# Altium schematic sheet MCU.SchDoc
size A
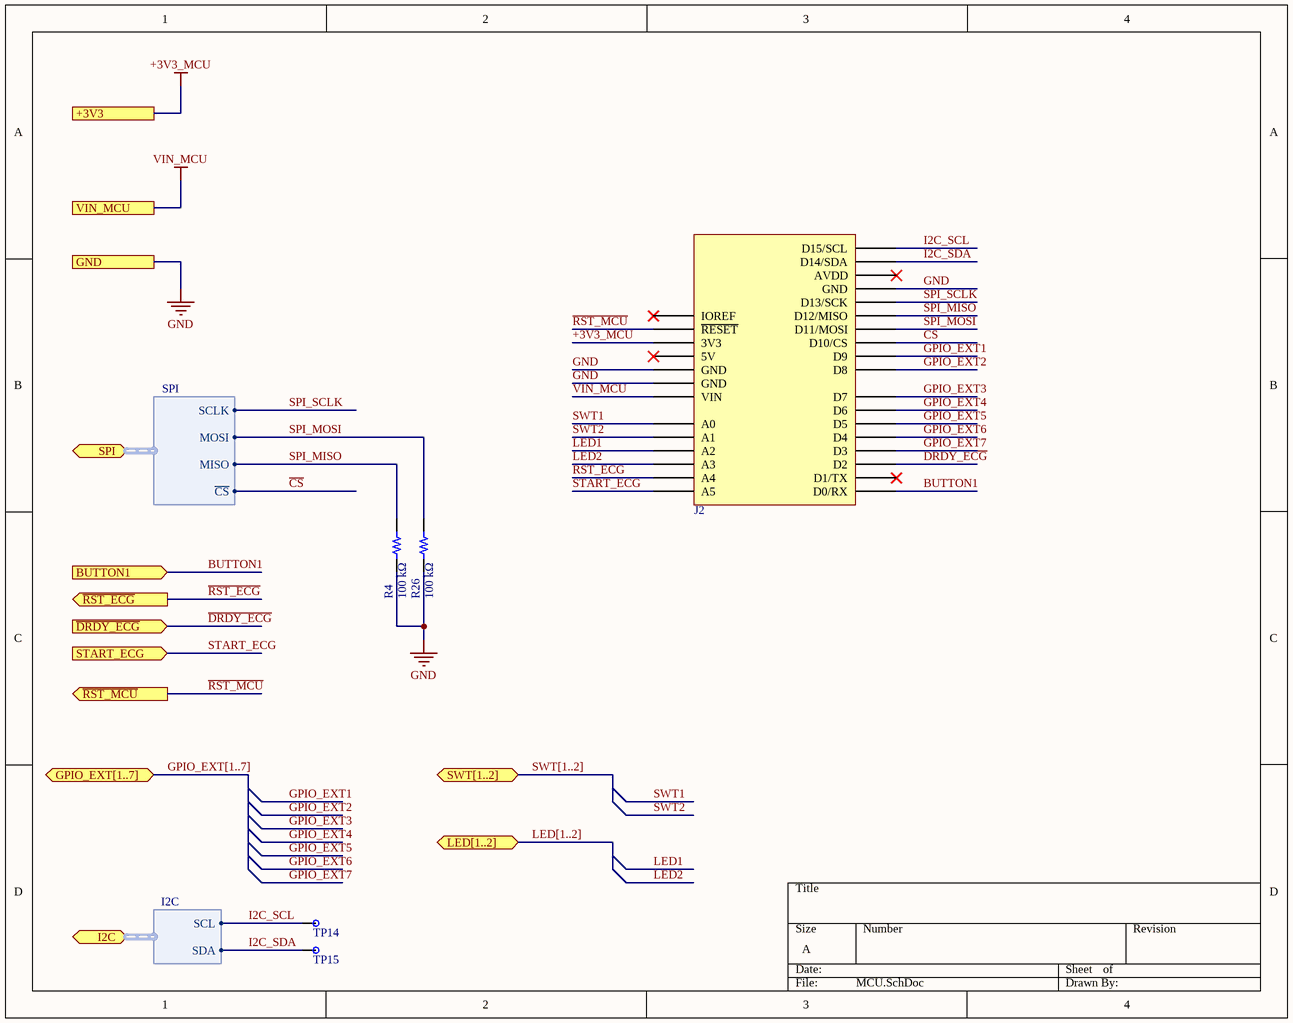
[diagram p0: MCU.SchDoc]

## Parts
J2  920-0088-01  [SCHMARTBOARD - 920-0088-01]  (value not drawn)
R4  100 kΩ  [RES 0402_1005]
R26  100 kΩ  [RES 0402_1005]
TP14  TP1MM  [Test Point 1MM]  (value not drawn)  (no BOM)
TP15  TP1MM  [Test Point 1MM]  (value not drawn)  (no BOM)

## Ports
+3V3, BUTTON1 (in), GND, GPIO_EXT[1..7] (bidir), I2C (bidir, harness I2C), LED[1..2] (bidir), SPI (bidir, harness SPI), START_ECG (in), SWT[1..2] (bidir), VIN_MCU, ~{DRDY_ECG} (in), ~{RST_ECG} (out), ~{RST_MCU} (out)

## Harnesses
SPI: SCLK, MOSI, MISO, ~{CS}
I2C: SCL, SDA

## Nets
+3V3_MCU: J2.4(3V3) ; port +3V3
GND: J2.6(GND) J2.7(GND) J2.29(GND) R4.2 R26.2 ; port GND
VIN_MCU: J2.8(VIN) ; port VIN_MCU
~{RST_MCU}: J2.3(~{RESET}) ; port ~{RST_MCU}
BUTTON1: J2.15(D0/RX) ; port BUTTON1
~{CS}: J2.25(D10/CS) ; port SPI.~{CS}
~{DRDY_ECG}: J2.17(D2) ; port ~{DRDY_ECG}
GPIO_EXT1: J2.24(D9)
GPIO_EXT2: J2.23(D8)
GPIO_EXT3: J2.22(D7)
GPIO_EXT4: J2.21(D6)
GPIO_EXT5: J2.20(D5)
GPIO_EXT6: J2.19(D4)
GPIO_EXT7: J2.18(D3)
I2C_SCL: J2.32(D15/SCL) TP14.1 ; port I2C.SCL
I2C_SDA: J2.31(D14/SDA) TP15.1 ; port I2C.SDA
LED1: J2.11(A2)
LED2: J2.12(A3)
~{RST_ECG}: J2.13(A4) ; port ~{RST_ECG}
SPI_MISO: J2.27(D12/MISO) R4.1 ; port SPI.MISO
SPI_MOSI: J2.26(D11/MOSI) R26.1 ; port SPI.MOSI
SPI_SCLK: J2.28(D13/SCK) ; port SPI.SCLK
START_ECG: J2.14(A5) ; port START_ECG
SWT1: J2.9(A0)
SWT2: J2.10(A1)

Not connected (* = marked no-connect by the designer): J2 2(IOREF)* 5(5V)* 16(D1/TX)* 30(AVDD)*

## Buses and harness runs
bus GPIO_EXT[1..7] = port GPIO_EXT[1..7]
bus LED[1..2] = port LED[1..2]
bus SWT[1..2] = port SWT[1..2]

## Library data of the parts
J2 = 920-0088-01: CONN HDR 8/10P 0.1 GOLD PCB 6PC; Manufacturer: Schmartboard, Inc.; Connector Type: Header; Contact Length - Post: 0.413" (10.50mm); Number of Positions: 6, 8, 10; Number of Positions Loaded: All; Pitch - Mating: 0.100" (2.54mm); Style: Board to Board; Part Number: 920-0088-01; ComponentLink1Description: Datasheet; ComponentLink1URL: http://schmartboard.com/content/Brochures/920-0088-01.pdf; ComponentLink2Description: DigiKey Link; ComponentLink2URL: http://digikey.com/product-detail/en/schmartboard-inc/920-0088-01/1988-1036-ND/9559319; Contact Finish - Mating: Gold; Contact Finish - Post: Gold; Contact Type: Female Socket; Fastening Type: Push-Pull; Insulation Color: Black; Insulation Height: 0.335" (8.51mm); LastUpdated: 2020-02-03 5:11:42 PM; Lifecycle Status: Active; Minimum Order: 1; Mounting Type: Through Hole; Number of Rows: 1; Packaging: Bulk; Part Status: Active; Price: 5.00; Series: -; Supplier 1: DigiKey; Supplier Part Number 1: 1988-1036-ND; Termination: Solder
R4 R26 = AC0402FR-07100KL: RES SMD 100K OHM 1% 1/16W 0402; Manufacturer: Yageo; Power (Watts): 0.063W, 1/16W; Temperature Coefficient: ±100ppm/°C; Value: 100 kOhms; Part Number: AC0402FR-07100KL; ComponentLink1Description: Datasheet; ComponentLink1URL: https://www.yageo.com/upload/media/product/productsearch/datasheet/rchip/PYu-AC_51_RoHS_L_7.pdf; ComponentLink2Description: DigiKey Link; ComponentLink2URL: http://digikey.com/product-detail/en/yageo/AC0402FR-07100KL/YAG3434CT-ND/6006283; Composition: Thick Film; Device Package: 0402 (1005 Metric); Features: Automotive AEC-Q200, Moisture Resistant; Height - Seated (Max): 0.015" (0.37mm); LastUpdated: 2020-02-19 6:28:05 AM; Lifecycle Status: Active; Minimum Order: 1; Number of Terminations: 2; Operating Temperature: -55°C ~ 155°C; Package / Case: 0402 (1005 Metric); Packaging: CutTape; Part Status: Active; Price: 0.10; Ratings: AEC-Q200; Resistance: 100 kΩ; Series: AC; Size / Dimension: 0.039" L x 0.020" W (1.00mm x 0.50mm); Supplier 1: DigiKey; Supplier Part Number 1: YAG3434CT-ND; Supplier Device Package: 0402; Tolerance: ±1%
TP14 TP15 = TP1MM: 1MM Circular Test Point; Part Number: TP1MM